# Altium project TU_ADV_PRJ.PrjPcb
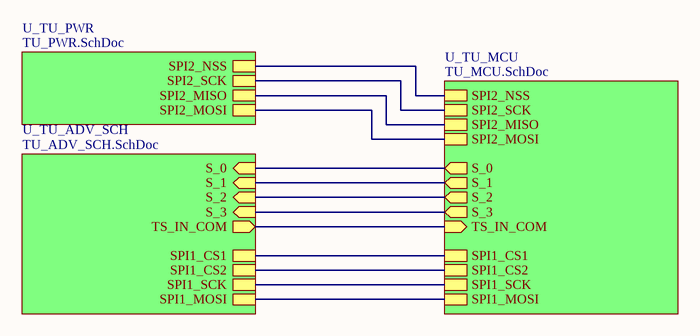
[diagram p0: TU_MAIN.SchDoc]
4 sheets, 200 parts. Net scope: hierarchical (ports join the sheet entries above them; power ports are global).
Board file: TU_ADV_PCB.PcbDoc
Sheets:
  TU_MAIN.SchDoc
    U_TU_PWR = TU_PWR.SchDoc
    U_TU_MCU = TU_MCU.SchDoc
    U_TU_ADV_SCH = TU_ADV_SCH.SchDoc

## Sheet TU_MAIN.SchDoc
size 1651 x 1651 mm

### Sub-sheets
U_TU_ADV_SCH = TU_ADV_SCH.SchDoc: TS_IN_COM (out), SPI1_CS1, SPI1_CS2, SPI1_MOSI, SPI1_SCK, S_0 (in), S_1 (in), S_2 (in), S_3 (in)
U_TU_MCU = TU_MCU.SchDoc: SPI2_NSS, SPI2_SCK, SPI2_MISO, SPI2_MOSI, S_0 (out), S_1 (out), S_2 (out), S_3 (out), TS_IN_COM (in), SPI1_CS2, SPI1_SCK, SPI1_MOSI, SPI1_CS1
U_TU_PWR = TU_PWR.SchDoc: SPI2_NSS, SPI2_MOSI, SPI2_MISO, SPI2_SCK

### Nets
SPI1_MOSI: sheet U_TU_MCU/SPI1_MOSI, sheet U_TU_ADV_SCH/SPI1_MOSI
SPI1_SCK: sheet U_TU_MCU/SPI1_SCK, sheet U_TU_ADV_SCH/SPI1_SCK
SPI2_MISO: sheet U_TU_PWR/SPI2_MISO, sheet U_TU_MCU/SPI2_MISO
SPI2_MOSI: sheet U_TU_PWR/SPI2_MOSI, sheet U_TU_MCU/SPI2_MOSI
SPI2_NSS: sheet U_TU_PWR/SPI2_NSS, sheet U_TU_MCU/SPI2_NSS
SPI2_SCK: sheet U_TU_PWR/SPI2_SCK, sheet U_TU_MCU/SPI2_SCK
NetR145_2: sheet U_TU_MCU/SPI1_CS1, sheet U_TU_ADV_SCH/SPI1_CS1
NetR146_2: sheet U_TU_MCU/SPI1_CS2, sheet U_TU_ADV_SCH/SPI1_CS2
NetU34_1: sheet U_TU_MCU/TS_IN_COM, sheet U_TU_ADV_SCH/TS_IN_COM
NetU34_10: sheet U_TU_MCU/S_0, sheet U_TU_ADV_SCH/S_0
NetU34_11: sheet U_TU_MCU/S_1, sheet U_TU_ADV_SCH/S_1
NetU34_13: sheet U_TU_MCU/S_3, sheet U_TU_ADV_SCH/S_3
NetU34_14: sheet U_TU_MCU/S_2, sheet U_TU_ADV_SCH/S_2

## Sheet TU_PWR.SchDoc
size A0
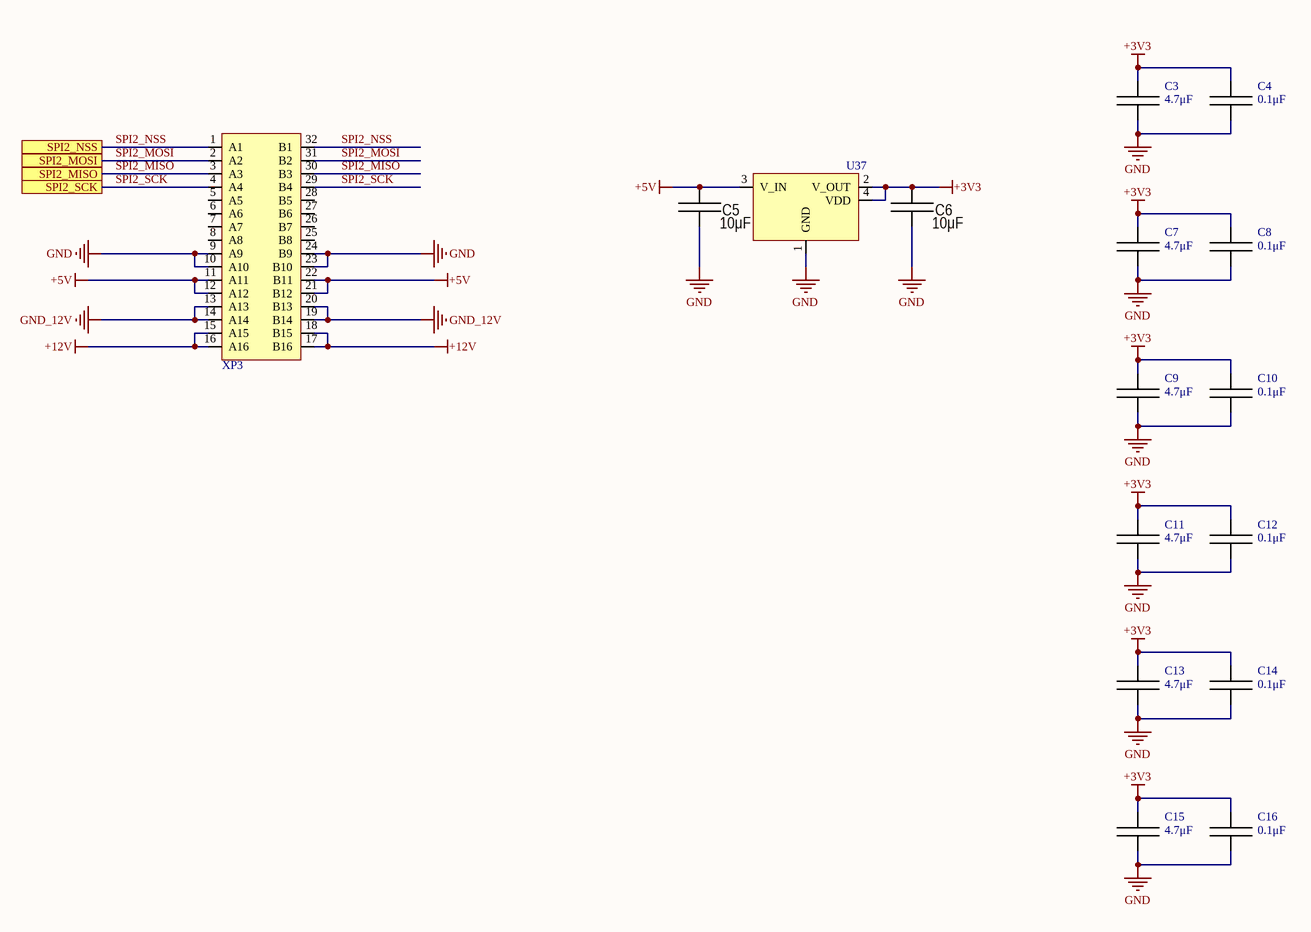
[diagram p1: TU_PWR.SchDoc]

### Parts
C3  value 4.7μF  [CAP: 0603]  (hidden comment: Cap_0603)
C4  value 0.1μF  [CAP: 0603]  (hidden comment: Cap_0603)
C5  value 10μF  [CAP: 1210]
C6  value 10μF  [CAP: 1210]
C7  value 4.7μF  [CAP: 0603]  (hidden comment: Cap_0603)
C8  value 0.1μF  [CAP: 0603]  (hidden comment: Cap_0603)
C9  value 4.7μF  [CAP: 0603]  (hidden comment: Cap_0603)
C10  value 0.1μF  [CAP: 0603]  (hidden comment: Cap_0603)
C11  value 4.7μF  [CAP: 0603]  (hidden comment: Cap_0603)
C12  value 0.1μF  [CAP: 0603]  (hidden comment: Cap_0603)
C13  value 4.7μF  [CAP: 0603]  (hidden comment: Cap_0603)
C14  value 0.1μF  [CAP: 0603]  (hidden comment: Cap_0603)
C15  value 4.7μF  [CAP: 0603]  (hidden comment: Cap_0603)
C16  value 0.1μF  [CAP: 0603]  (hidden comment: Cap_0603)
U37  LD1117S33CTR4  [SOT-223-3]  (value not drawn)
XP3  DS1118-32M-R23  [DS1118-32M-R23]  (value not drawn)

### Ports
SPI2_MISO, SPI2_MOSI, SPI2_NSS, SPI2_SCK

### Nets
+3V3: C3.2 C4.2 C6.2 C7.2 C8.2 C9.2 C10.2 C11.2 C12.2 C13.2 C14.2 C15.2 C16.2 U37.2(V_OUT) U37.4(VDD)  [project net VCC_3.3V_CLEAR]
+5V: C5.2 U37.3(V_IN) XP3.11(A11) XP3.12(A12) XP3.21(B12) XP3.22(B11)
+12V: XP3.15(A15) XP3.16(A16) XP3.17(B16) XP3.18(B15)
GND: C3.1 C4.1 C5.1 C6.1 C7.1 C8.1 C9.1 C10.1 C11.1 C12.1 C13.1 C14.1 C15.1 C16.1 U37.1(GND) XP3.9(A9) XP3.10(A10) XP3.23(B10) XP3.24(B9)
GND_12V: XP3.13(A13) XP3.14(A14) XP3.19(B14) XP3.20(B13)
SPI2_MISO: XP3.3(A3) XP3.30(B3) ; port SPI2_MISO
SPI2_MOSI: XP3.2(A2) XP3.31(B2) ; port SPI2_MOSI
SPI2_NSS: XP3.1(A1) XP3.32(B1) ; port SPI2_NSS
SPI2_SCK: XP3.4(A4) XP3.29(B4) ; port SPI2_SCK

Not connected (* = marked no-connect by the designer): XP3 5(A5) 6(A6) 7(A7) 8(A8) 25(B8) 26(B7) 27(B6) 28(B5)

### Library data of the parts
C3 C7 C9 C11 C13 C15 = Cap_0603: TypeDielectric: X7R(X5R); Voltage: 25V; Package/Case: 0603; Temperature: -55...+125°C(-55...+85°C); Product Category: Capacitors
C4 C8 C10 C12 C14 C16 = Cap_0603: TypeDielectric: X7R(X5R); Voltage: 16V; Package/Case: 0603; Temperature: -55...+125°C(-55...+85°C); Product Category: Capacitors
C5 C6 = Ceramic_1210: Manufacturer: Yageo; PartNumber: CC1210KKX7R9BB104; TypeCapacitor: Ceramic capacitor; Tolerance: ±10%; TypeDielectric: X7R; Package: 1210; HelpURL: https://www.digikey.com/product-detail/en/yageo/CC1210KKX7R9BB104/311-4522-1-ND/8025611; ValueManufacturerPartNumber: =TypeCapacitor+', '+Value+', '+TypeDielectric+', '+Tolerance+', '+Voltage+', '+Package+', '+Temperature; Temperature: -55...+125°C
U37 = LD1117S33CTR: LDO Voltage Regulator 3.3V 0.8A Positive; Manufacturer: STMicroelectronics; Datasheet: https://eu.mouser.com/datasheet/2/389/cd00000544-1795431.pdf; HelpURL: https://eu.mouser.com/ProductDetail/STMicroelectronics/LD1117S33CTR?qs=8u%2FLf1IQwKF9meFZLHfRog%3D%3D; Package/Case: SOT-223-3; Product Category: Voltage Regulators
XP3 = DS1118-32M-R23: DIN 41612 Connector; Manufacturer: Connfly; Analogue: HARTING 09221326951(https://eu.mouser.com/ProductDetail/HARTING/09221326951?qs=Afqhj6cPmO9f0oVZo6yWiA%3D%3D); Datasheet: http://en.connfly.group/static/upload/file/pdf/DS1118.pdf; HelpURL: https://www.chipdip.by/product/din41612r-ds1118-32m-r23; Product Category: Connectors

## Sheet TU_MCU.SchDoc
size 500 x 500 mm
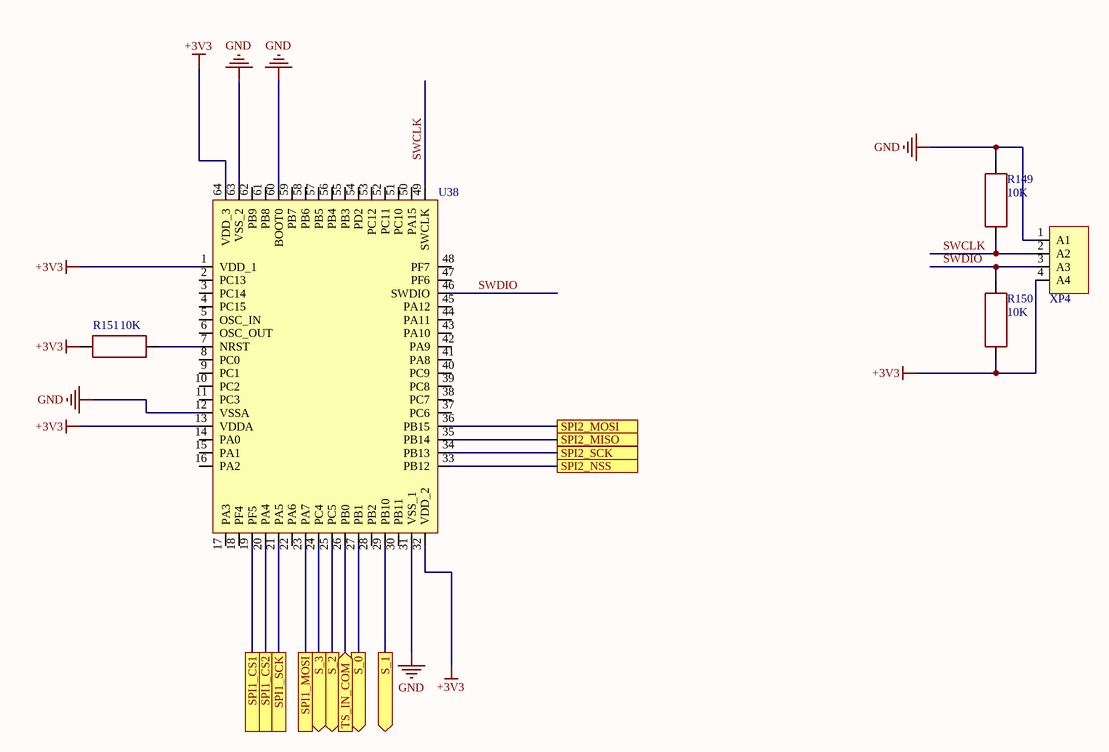
[diagram p2: TU_MCU.SchDoc]

### Parts
R149  value 10K  [RES: 0603]  (hidden comment: Resistor_0603)
R150  value 10K  [RES: 0603]  (hidden comment: Resistor_0603)
R151  value 10K  [RES: 0603]  (hidden comment: Resistor_0603)
U38  STM32F030R8T6TR  [LQFP-64]  (value not drawn)
XP4  PLS-6 (DS1021-1x6)  [PLS-4 (DS1021-1x4)]  (value not drawn)

### Ports
S_0 (out), S_1 (out), S_2 (out), S_3 (out), SPI1_CS1, SPI1_CS2, SPI1_MOSI, SPI1_SCK, SPI2_MISO, SPI2_MOSI, SPI2_NSS, SPI2_SCK, TS_IN_COM (in)

### Nets
+3V3: R150.2 R151.1 U38.1(VDD_1) U38.13(VDDA) U38.32(VDD_2) U38.64(VDD_3) XP4.4(A4)  [project net VCC_3.3V_CLEAR]
GND: R149.1 U38.12(VSSA) U38.31(VSS_1) U38.60(BOOT0) U38.63(VSS_2) XP4.1(A1)
SPI1_MOSI: U38.23(PA7) ; port SPI1_MOSI
SPI1_SCK: U38.21(PA5) ; port SPI1_SCK
SPI2_MISO: U38.35(PB14) ; port SPI2_MISO
SPI2_MOSI: U38.36(PB15) ; port SPI2_MOSI
SPI2_NSS: U38.33(PB12) ; port SPI2_NSS
SPI2_SCK: U38.34(PB13) ; port SPI2_SCK
SWCLK: R149.2 U38.49(SWCLK) XP4.2(A2)
SWDIO: R150.1 U38.46(SWDIO) XP4.3(A3)
NetR145_2: U38.19(PF5) ; port SPI1_CS1
NetR146_2: U38.20(PA4) ; port SPI1_CS2
NetR151_2: R151.2 U38.7(NRST)
NetU34_1: U38.26(PB0) ; port TS_IN_COM
NetU34_10: U38.27(PB1) ; port S_0
NetU34_11: U38.29(PB10) ; port S_1
NetU34_13: U38.24(PC4) ; port S_3
NetU34_14: U38.25(PC5) ; port S_2

Not connected (* = marked no-connect by the designer): U38 2(PC13) 3(PC14) 4(PC15) 5(OSC_IN) 6(OSC_OUT) 8(PC0) 9(PC1) 10(PC2) 11(PC3) 14(PA0) 15(PA1) 16(PA2) 17(PA3) 18(PF4) 22(PA6) 28(PB2) 30(PB11) 37(PC6) 38(PC7) 39(PC8) 40(PC9) 41(PA8) 42(PA9) 43(PA10) 44(PA11) 45(PA12) 47(PF6) 48(PF7) 50(PA15) 51(PC10) 52(PC11) 53(PC12) 54(PD2) 55(PB3) 56(PB4) 57(PB5) 58(PB6) 59(PB7) 61(PB8) 62(PB9)

### Library data of the parts
R149-R151 = Resistor_0603: Power: 0.1W; Tolerance: ±1%; Package/Case: 0603; Temperature: -55...+125°C; Product Category: Resistors
U38 = STM32F030R8T6TR: MCU Mainstream Arm Cortex-M0 Value line MCU 64 Kbytes of Flash , 48 MHz CPU; Manufacturer: STMicroelectronics; Datasheet: https://www.st.com/resource/en/datasheet/stm32f030r8.pdf; HelpURL: https://eu.mouser.com/ProductDetail/STMicroelectronics/STM32F030R8T6TR?qs=s5SkPsIz10%252B%252B1w15QiyTpQ%3D%3D; Package/Case: LQFP-64; Product Category: Microcontrollers
XP4 = PLS-4 (DS1021-1x4): Board to Board, Surface Mount, Single row, 6 Positions, 2.54mm, Vertical.; Manufacturer: Connfly; Datasheet: https://static.chipdip.ru/lib/977/DOC005977245.pdf; HelpURL: https://www.chipdip.by/product/pls-4; Product Category: Connectors

## Sheet TU_ADV_SCH.SchDoc
size 1651 x 1651 mm
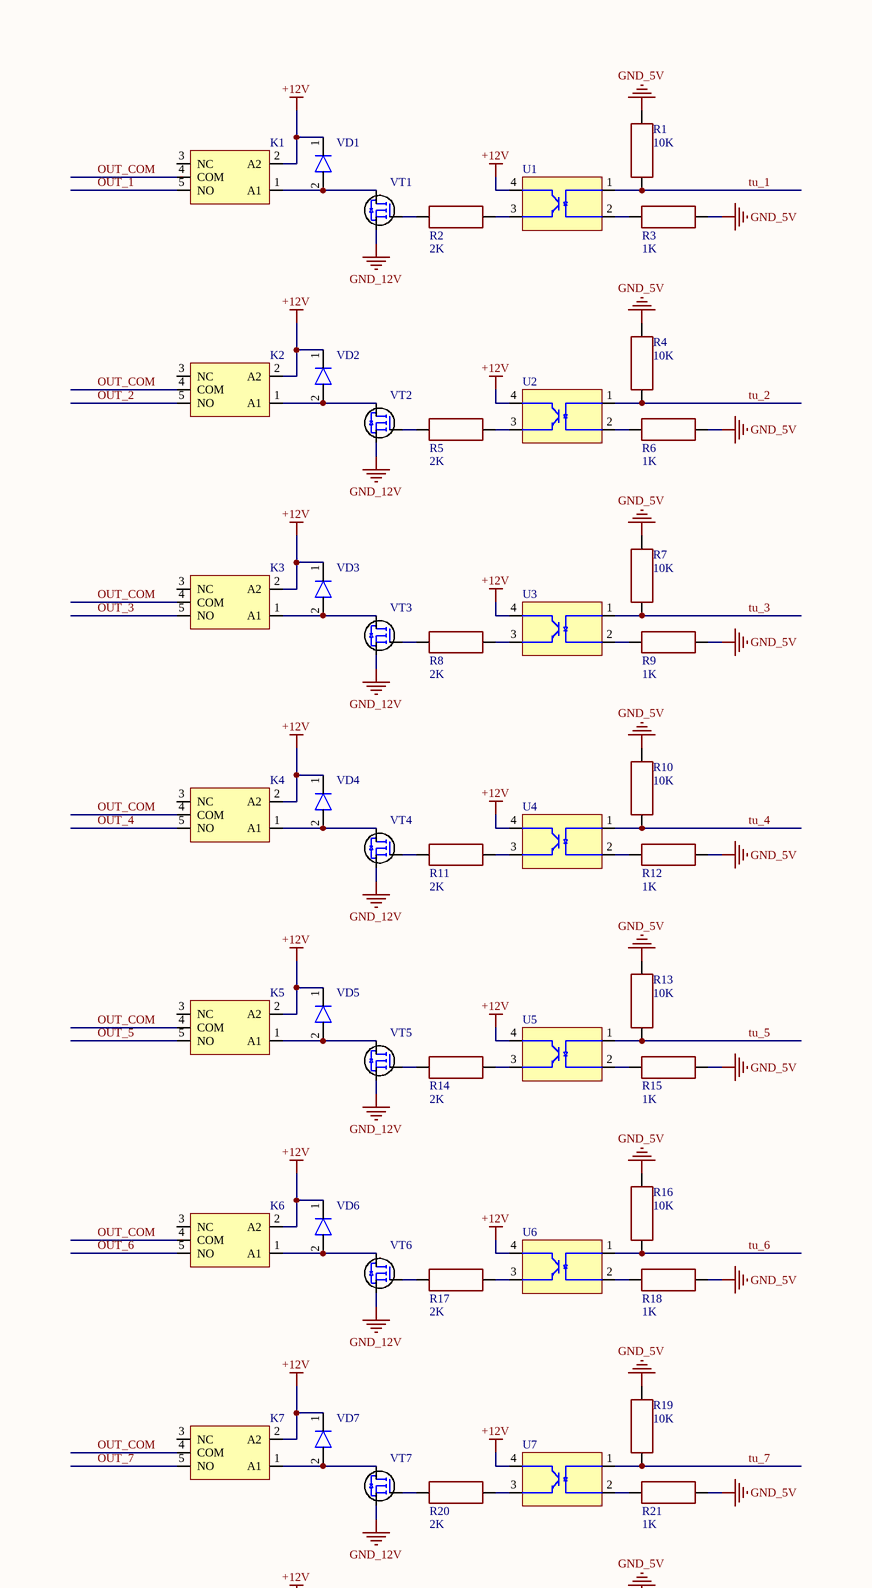
[diagram p3: TU_ADV_SCH.SchDoc, row 1 of 5 left]
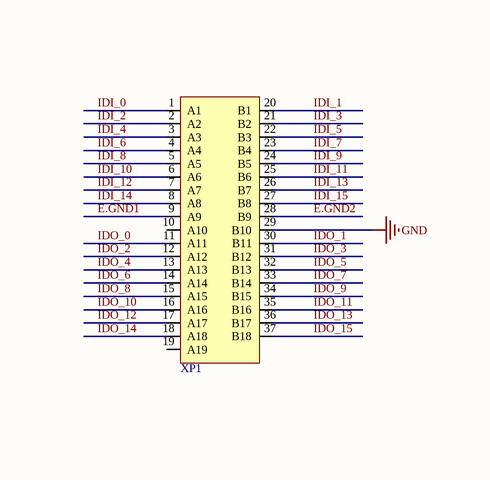
[diagram p4: TU_ADV_SCH.SchDoc, row 1 of 5 right]
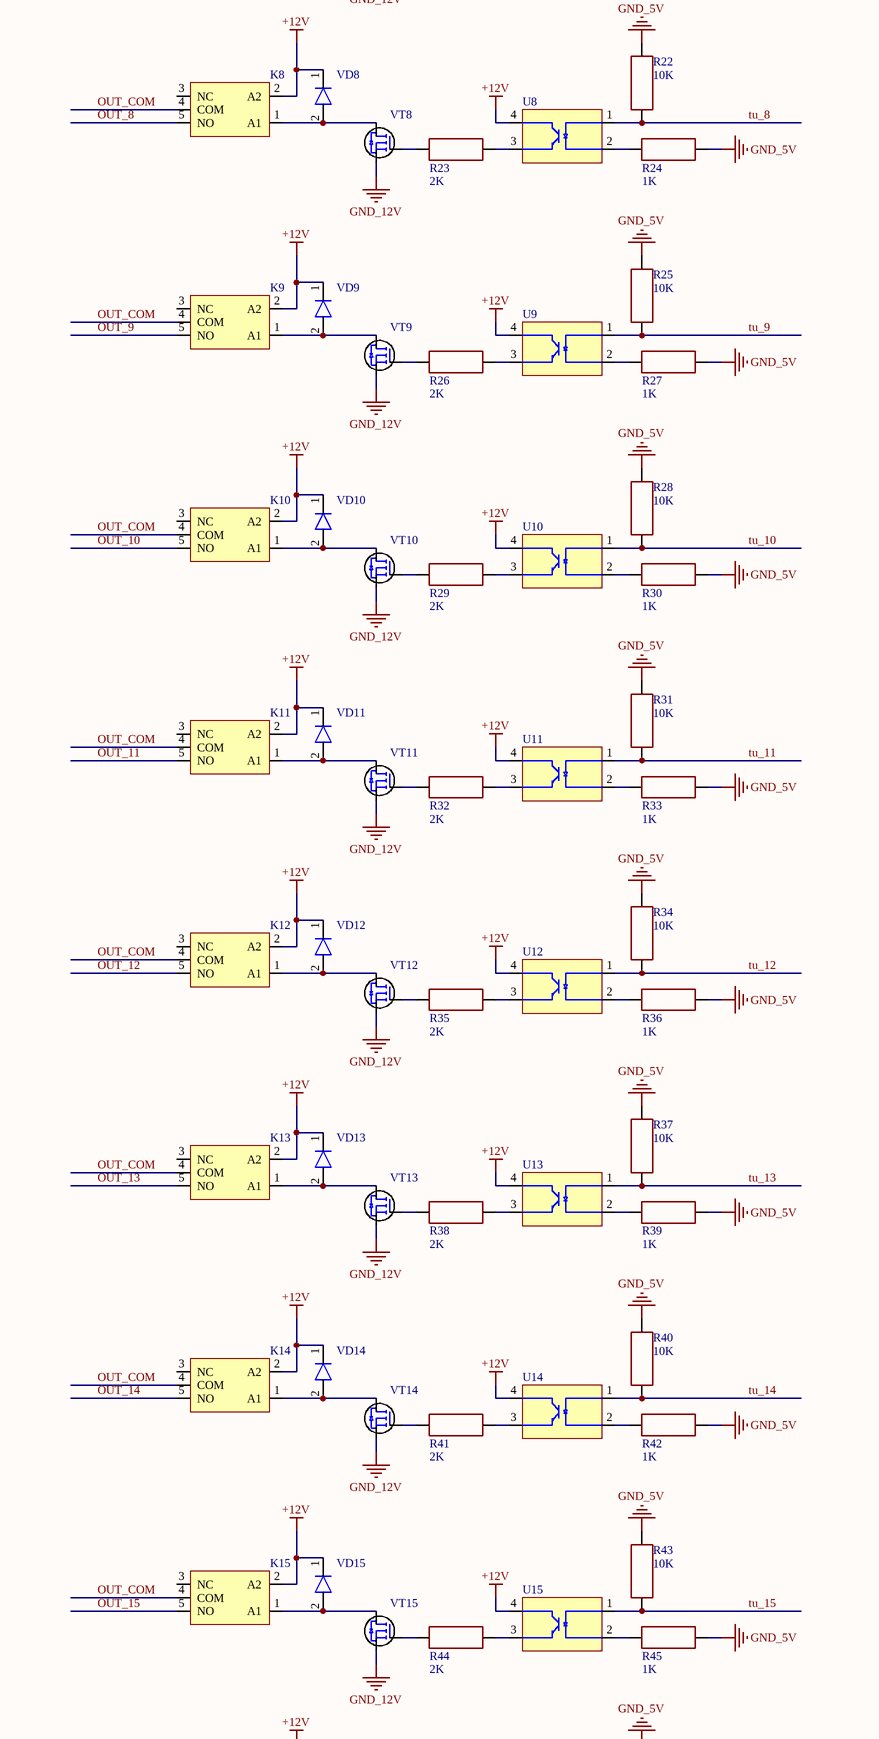
[diagram p5: TU_ADV_SCH.SchDoc, row 2 of 5 left]
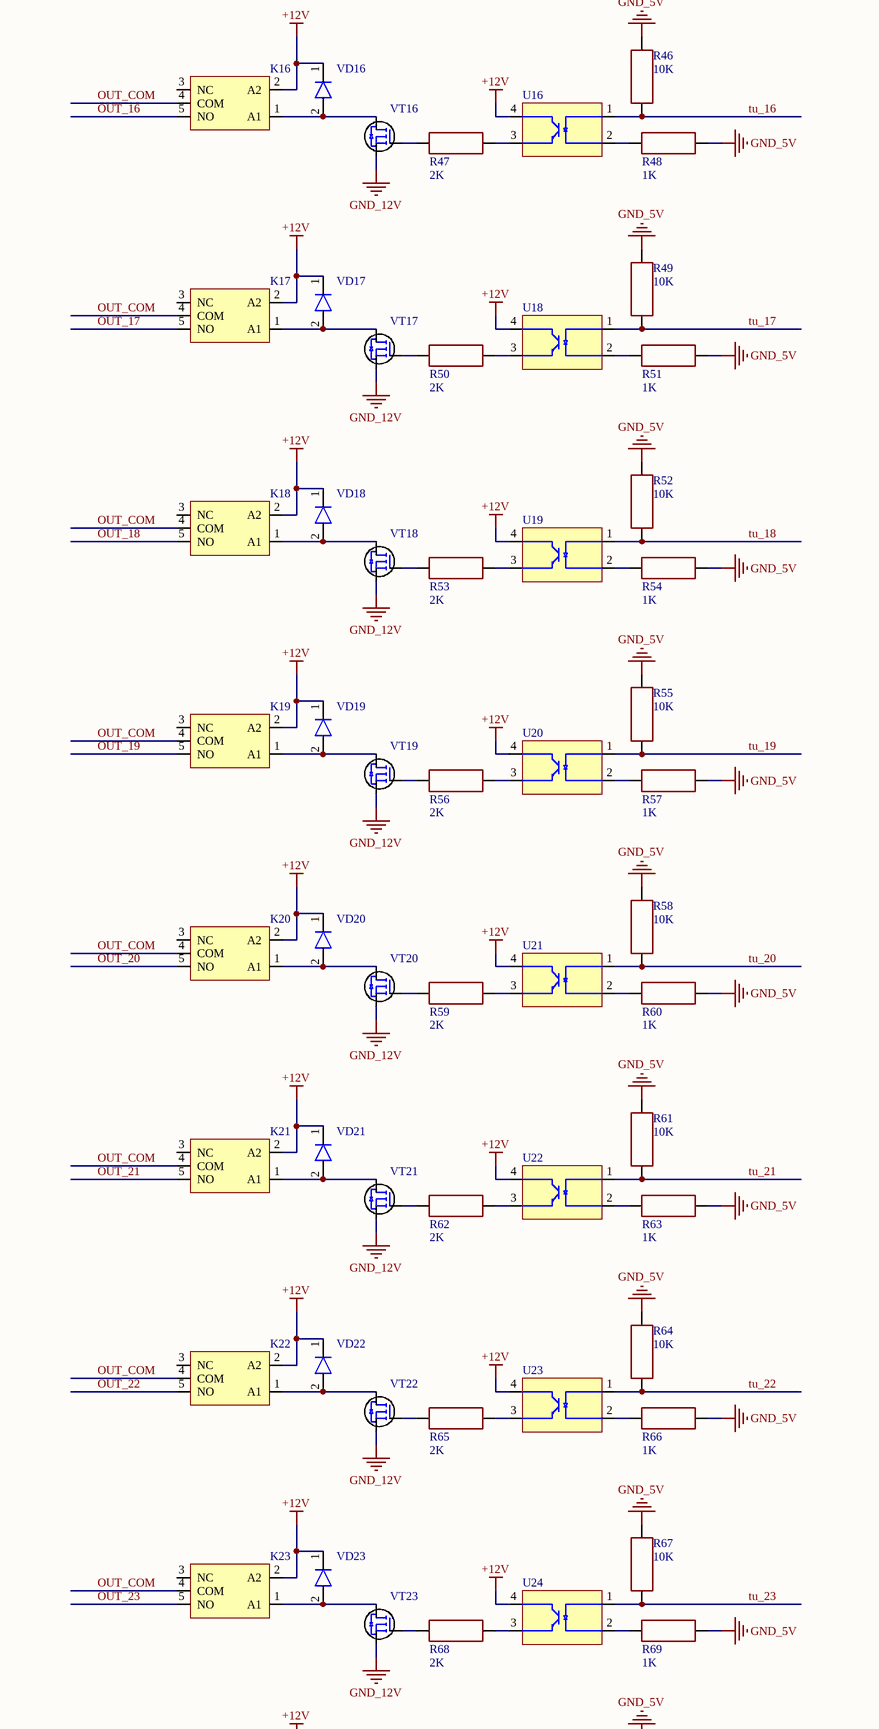
[diagram p6: TU_ADV_SCH.SchDoc, row 3 of 5 left]
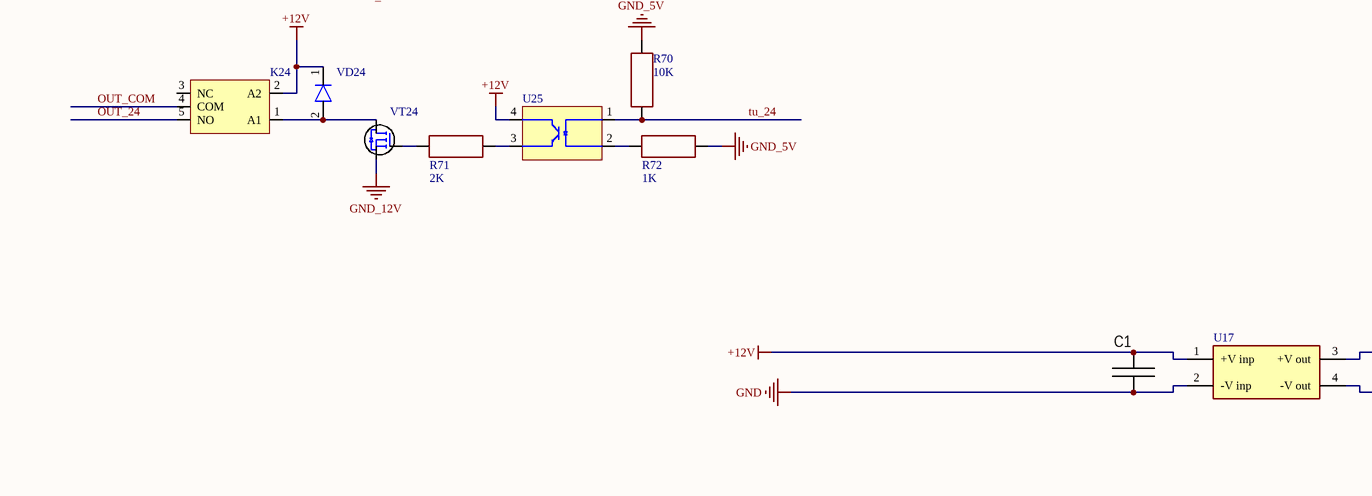
[diagram p7: TU_ADV_SCH.SchDoc, row 4 of 5 left]
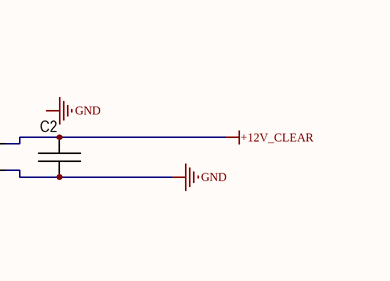
[diagram p8: TU_ADV_SCH.SchDoc, row 4 of 5 right]
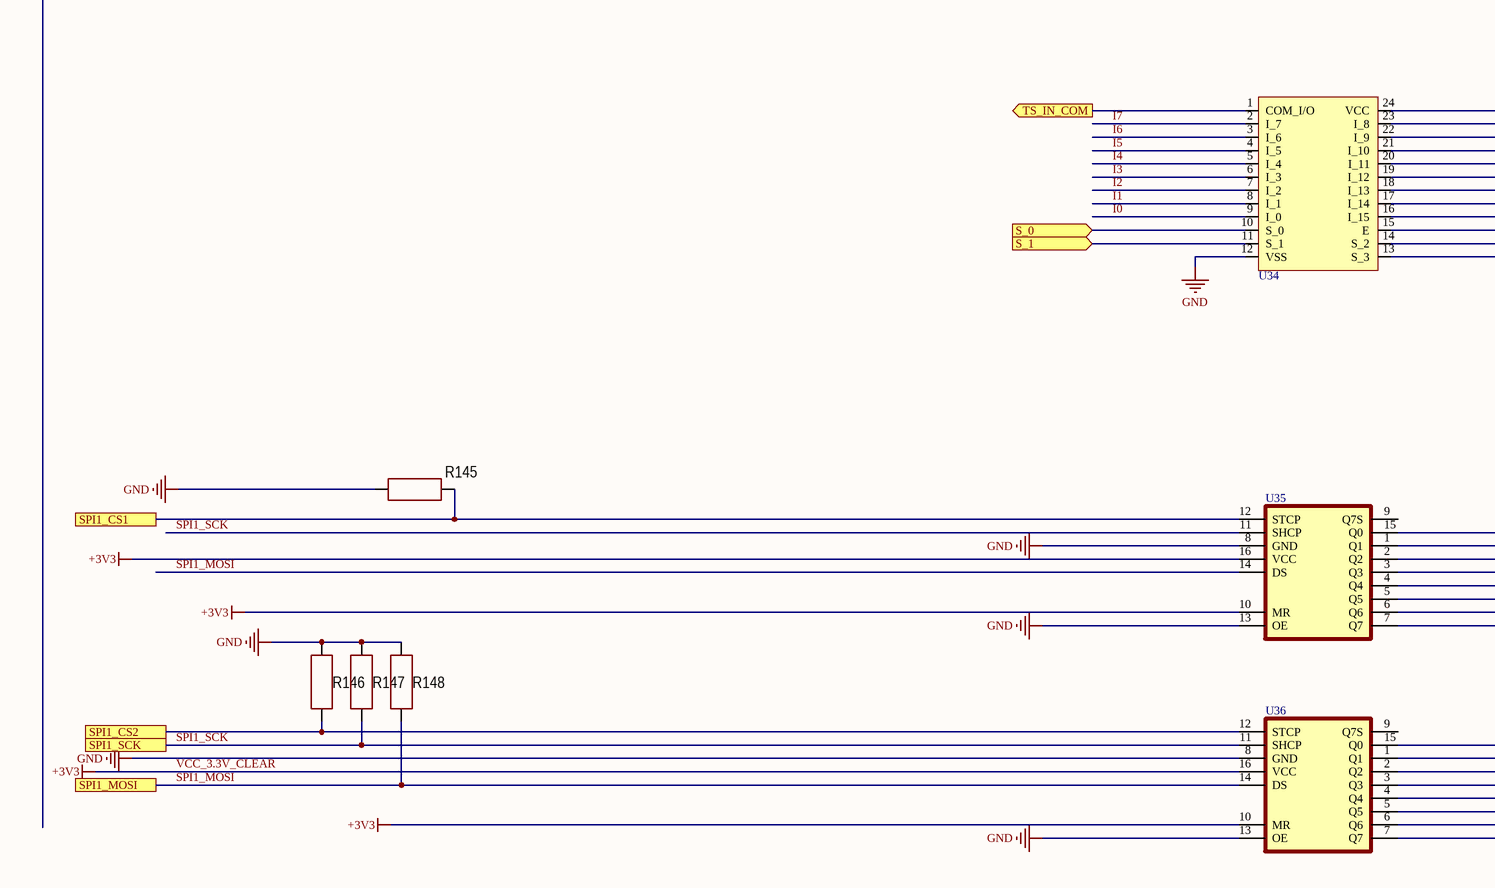
[diagram p9: TU_ADV_SCH.SchDoc, row 5 of 5 left]
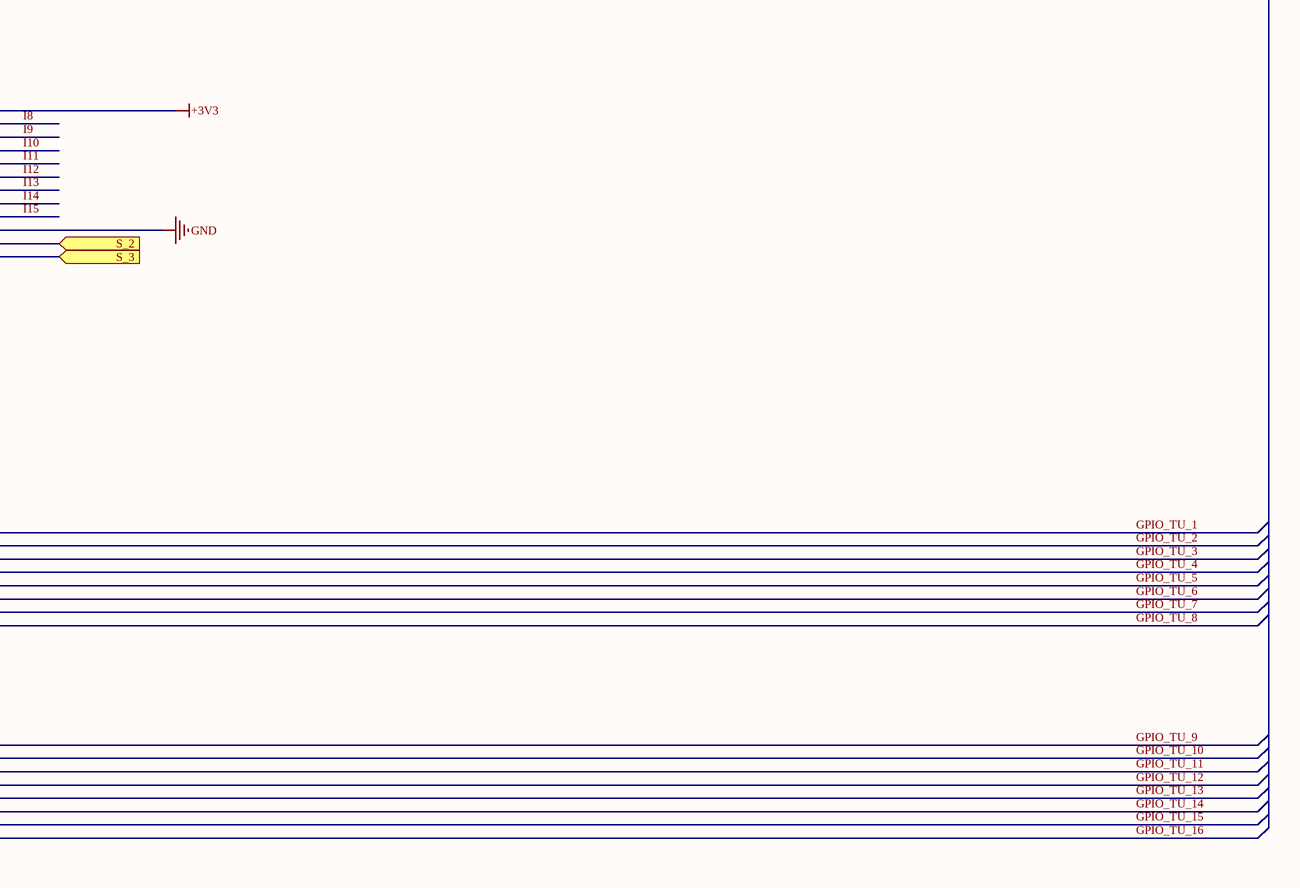
[diagram p10: TU_ADV_SCH.SchDoc, row 5 of 5 right]

### Parts
C1  (no value)  [CAP: 2220]
C2  (no value)  [CAP: 2220]
K1  RM96-3011-35-1012  [RM96]  (value not drawn)
K2  RM96-3011-35-1012  [RM96]  (value not drawn)
K3  RM96-3011-35-1012  [RM96]  (value not drawn)
K4  RM96-3011-35-1012  [RM96]  (value not drawn)
K5  RM96-3011-35-1012  [RM96]  (value not drawn)
K6  RM96-3011-35-1012  [RM96]  (value not drawn)
K7  RM96-3011-35-1012  [RM96]  (value not drawn)
K8  RM96-3011-35-1012  [RM96]  (value not drawn)
K9  RM96-3011-35-1012  [RM96]  (value not drawn)
K10  RM96-3011-35-1012  [RM96]  (value not drawn)
K11  RM96-3011-35-1012  [RM96]  (value not drawn)
K12  RM96-3011-35-1012  [RM96]  (value not drawn)
K13  RM96-3011-35-1012  [RM96]  (value not drawn)
K14  RM96-3011-35-1012  [RM96]  (value not drawn)
K15  RM96-3011-35-1012  [RM96]  (value not drawn)
K16  RM96-3011-35-1012  [RM96]  (value not drawn)
K17  RM96-3011-35-1012  [RM96]  (value not drawn)
K18  RM96-3011-35-1012  [RM96]  (value not drawn)
K19  RM96-3011-35-1012  [RM96]  (value not drawn)
K20  RM96-3011-35-1012  [RM96]  (value not drawn)
K21  RM96-3011-35-1012  [RM96]  (value not drawn)
K22  RM96-3011-35-1012  [RM96]  (value not drawn)
K23  RM96-3011-35-1012  [RM96]  (value not drawn)
K24  RM96-3011-35-1012  [RM96]  (value not drawn)
R1  value 10K  [RES: 0402]
R2  value 2K  [RES: 0402]
R3  value 1K  [RES: 0402]
R4  value 10K  [RES: 0402]
R5  value 2K  [RES: 0402]
R6  value 1K  [RES: 0402]
R7  value 10K  [RES: 0402]
R8  value 2K  [RES: 0402]
R9  value 1K  [RES: 0402]
R10  value 10K  [RES: 0402]
R11  value 2K  [RES: 0402]
R12  value 1K  [RES: 0402]
R13  value 10K  [RES: 0402]
R14  value 2K  [RES: 0402]
R15  value 1K  [RES: 0402]
R16  value 10K  [RES: 0402]
R17  value 2K  [RES: 0402]
R18  value 1K  [RES: 0402]
R19  value 10K  [RES: 0402]
R20  value 2K  [RES: 0402]
R21  value 1K  [RES: 0402]
R22  value 10K  [RES: 0402]
R23  value 2K  [RES: 0402]
R24  value 1K  [RES: 0402]
R25  value 10K  [RES: 0402]
R26  value 2K  [RES: 0402]
R27  value 1K  [RES: 0402]
R28  value 10K  [RES: 0402]
R29  value 2K  [RES: 0402]
R30  value 1K  [RES: 0402]
R31  value 10K  [RES: 0402]
R32  value 2K  [RES: 0402]
R33  value 1K  [RES: 0402]
R34  value 10K  [RES: 0402]
R35  value 2K  [RES: 0402]
R36  value 1K  [RES: 0402]
R37  value 10K  [RES: 0402]
R38  value 2K  [RES: 0402]
R39  value 1K  [RES: 0402]
R40  value 10K  [RES: 0402]
R41  value 2K  [RES: 0402]
R42  value 1K  [RES: 0402]
R43  value 10K  [RES: 0402]
R44  value 2K  [RES: 0402]
R45  value 1K  [RES: 0402]
R46  value 10K  [RES: 0402]
R47  value 2K  [RES: 0402]
R48  value 1K  [RES: 0402]
R49  value 10K  [RES: 0402]
R50  value 2K  [RES: 0402]
R51  value 1K  [RES: 0402]
R52  value 10K  [RES: 0402]
R53  value 2K  [RES: 0402]
R54  value 1K  [RES: 0402]
R55  value 10K  [RES: 0402]
R56  value 2K  [RES: 0402]
R57  value 1K  [RES: 0402]
R58  value 10K  [RES: 0402]
R59  value 2K  [RES: 0402]
R60  value 1K  [RES: 0402]
R61  value 10K  [RES: 0402]
R62  value 2K  [RES: 0402]
R63  value 1K  [RES: 0402]
R64  value 10K  [RES: 0402]
R65  value 2K  [RES: 0402]
R66  value 1K  [RES: 0402]
R67  value 10K  [RES: 0402]
R68  value 2K  [RES: 0402]
R69  value 1K  [RES: 0402]
R70  value 10K  [RES: 0402]
R71  value 2K  [RES: 0402]
R72  value 1K  [RES: 0402]
R145  (no value)  [RES: 0603]
R146  (no value)  [RES: 0603]
R147  (no value)  [RES: 0603]
R148  (no value)  [RES: 0603]
U1  LTV-357T  [SMD-4]  (value not drawn)
U2  LTV-357T  [SMD-4]  (value not drawn)
U3  LTV-357T  [SMD-4]  (value not drawn)
U4  LTV-357T  [SMD-4]  (value not drawn)
U5  LTV-357T  [SMD-4]  (value not drawn)
U6  LTV-357T  [SMD-4]  (value not drawn)
U7  LTV-357T  [SMD-4]  (value not drawn)
U8  LTV-357T  [SMD-4]  (value not drawn)
U9  LTV-357T  [SMD-4]  (value not drawn)
U10  LTV-357T  [SMD-4]  (value not drawn)
U11  LTV-357T  [SMD-4]  (value not drawn)
U12  LTV-357T  [SMD-4]  (value not drawn)
U13  LTV-357T  [SMD-4]  (value not drawn)
U14  LTV-357T  [SMD-4]  (value not drawn)
U15  LTV-357T  [SMD-4]  (value not drawn)
U16  LTV-357T  [SMD-4]  (value not drawn)
U17  AM1D-1212SH  [AM1D-1212SH]  (value not drawn)
U18  LTV-357T  [SMD-4]  (value not drawn)
U19  LTV-357T  [SMD-4]  (value not drawn)
U20  LTV-357T  [SMD-4]  (value not drawn)
U21  LTV-357T  [SMD-4]  (value not drawn)
U22  LTV-357T  [SMD-4]  (value not drawn)
U23  LTV-357T  [SMD-4]  (value not drawn)
U24  LTV-357T  [SMD-4]  (value not drawn)
U25  LTV-357T  [SMD-4]  (value not drawn)
U34  CD74HC4067M96  [SOIC-24]  (value not drawn)
U35  74HC595  [74HC595]  (value not drawn)
U36  74HC595  [74HC595]  (value not drawn)
VD1  1N4148W-7-F  [SOD-123]  (value not drawn)
VD2  1N4148W-7-F  [SOD-123]  (value not drawn)
VD3  1N4148W-7-F  [SOD-123]  (value not drawn)
VD4  1N4148W-7-F  [SOD-123]  (value not drawn)
VD5  1N4148W-7-F  [SOD-123]  (value not drawn)
VD6  1N4148W-7-F  [SOD-123]  (value not drawn)
VD7  1N4148W-7-F  [SOD-123]  (value not drawn)
VD8  1N4148W-7-F  [SOD-123]  (value not drawn)
VD9  1N4148W-7-F  [SOD-123]  (value not drawn)
VD10  1N4148W-7-F  [SOD-123]  (value not drawn)
VD11  1N4148W-7-F  [SOD-123]  (value not drawn)
VD12  1N4148W-7-F  [SOD-123]  (value not drawn)
VD13  1N4148W-7-F  [SOD-123]  (value not drawn)
VD14  1N4148W-7-F  [SOD-123]  (value not drawn)
VD15  1N4148W-7-F  [SOD-123]  (value not drawn)
VD16  1N4148W-7-F  [SOD-123]  (value not drawn)
VD17  1N4148W-7-F  [SOD-123]  (value not drawn)
VD18  1N4148W-7-F  [SOD-123]  (value not drawn)
VD19  1N4148W-7-F  [SOD-123]  (value not drawn)
VD20  1N4148W-7-F  [SOD-123]  (value not drawn)
VD21  1N4148W-7-F  [SOD-123]  (value not drawn)
VD22  1N4148W-7-F  [SOD-123]  (value not drawn)
VD23  1N4148W-7-F  [SOD-123]  (value not drawn)
VD24  1N4148W-7-F  [SOD-123]  (value not drawn)
VT1  2N7002(NX7002AK)  [SOT-23-3]  (value not drawn)
VT2  2N7002(NX7002AK)  [SOT-23-3]  (value not drawn)
VT3  2N7002(NX7002AK)  [SOT-23-3]  (value not drawn)
VT4  2N7002(NX7002AK)  [SOT-23-3]  (value not drawn)
VT5  2N7002(NX7002AK)  [SOT-23-3]  (value not drawn)
VT6  2N7002(NX7002AK)  [SOT-23-3]  (value not drawn)
VT7  2N7002(NX7002AK)  [SOT-23-3]  (value not drawn)
VT8  2N7002(NX7002AK)  [SOT-23-3]  (value not drawn)
VT9  2N7002(NX7002AK)  [SOT-23-3]  (value not drawn)
VT10  2N7002(NX7002AK)  [SOT-23-3]  (value not drawn)
VT11  2N7002(NX7002AK)  [SOT-23-3]  (value not drawn)
VT12  2N7002(NX7002AK)  [SOT-23-3]  (value not drawn)
VT13  2N7002(NX7002AK)  [SOT-23-3]  (value not drawn)
VT14  2N7002(NX7002AK)  [SOT-23-3]  (value not drawn)
VT15  2N7002(NX7002AK)  [SOT-23-3]  (value not drawn)
VT16  2N7002(NX7002AK)  [SOT-23-3]  (value not drawn)
VT17  2N7002(NX7002AK)  [SOT-23-3]  (value not drawn)
VT18  2N7002(NX7002AK)  [SOT-23-3]  (value not drawn)
VT19  2N7002(NX7002AK)  [SOT-23-3]  (value not drawn)
VT20  2N7002(NX7002AK)  [SOT-23-3]  (value not drawn)
VT21  2N7002(NX7002AK)  [SOT-23-3]  (value not drawn)
VT22  2N7002(NX7002AK)  [SOT-23-3]  (value not drawn)
VT23  2N7002(NX7002AK)  [SOT-23-3]  (value not drawn)
VT24  2N7002(NX7002AK)  [SOT-23-3]  (value not drawn)
XP1  DRB-37FA(DS1037-37F)  [DRB-37FA(DS1037-37F)]  (value not drawn)

### Ports
S_0 (in), S_1 (in), S_2 (in), S_3 (in), SPI1_CS1, SPI1_CS2, SPI1_MOSI, SPI1_SCK, TS_IN_COM (out)

### Nets
+12V: C1.2 K1.2(A2) K2.2(A2) K3.2(A2) K4.2(A2) K5.2(A2) K6.2(A2) K7.2(A2) K8.2(A2) K9.2(A2) K10.2(A2) K11.2(A2) K12.2(A2) K13.2(A2) K14.2(A2) K15.2(A2) K16.2(A2) K17.2(A2) K18.2(A2) K19.2(A2) K20.2(A2) K21.2(A2) K22.2(A2) K23.2(A2) K24.2(A2) U1.4 U2.4 U3.4 U4.4 U5.4 U6.4 U7.4 U8.4 U9.4 U10.4 U11.4 U12.4 U13.4 U14.4 U15.4 U16.4 U17.1(+V_inp) U18.4 U19.4 U20.4 U21.4 U22.4 U23.4 U24.4 U25.4 VD1.1 VD2.1 VD3.1 VD4.1 VD5.1 VD6.1 VD7.1 VD8.1 VD9.1 VD10.1 VD11.1 VD12.1 VD13.1 VD14.1 VD15.1 VD16.1 VD17.1 VD18.1 VD19.1 VD20.1 VD21.1 VD22.1 VD23.1 VD24.1
+12V_CLEAR: C2.2 U17.3(+V_out)
GND: C1.1 C2.1 R145.1 R146.1 R147.1 R148.1 U17.2(-V_inp) U17.4(-V_out) U34.12(VSS) U34.15(E) U35.8(GND) U35.13(OE) U36.8(GND) U36.13(OE) XP1.29(B10)
GND_5V: R1.2 R3.2 R4.2 R6.2 R7.2 R9.2 R10.2 R12.2 R13.2 R15.2 R16.2 R18.2 R19.2 R21.2 R22.2 R24.2 R25.2 R27.2 R28.2 R30.2 R31.2 R33.2 R34.2 R36.2 R37.2 R39.2 R40.2 R42.2 R43.2 R45.2 R46.2 R48.2 R49.2 R51.2 R52.2 R54.2 R55.2 R57.2 R58.2 R60.2 R61.2 R63.2 R64.2 R66.2 R67.2 R69.2 R70.2 R72.2
GND_12V: VT1.3 VT2.3 VT3.3 VT4.3 VT5.3 VT6.3 VT7.3 VT8.3 VT9.3 VT10.3 VT11.3 VT12.3 VT13.3 VT14.3 VT15.3 VT16.3 VT17.3 VT18.3 VT19.3 VT20.3 VT21.3 VT22.3 VT23.3 VT24.3
VCC_3.3V_CLEAR: U34.24(VCC) U35.10(MR) U35.16(VCC) U36.10(MR) U36.16(VCC)  [also labelled +3V3]
E.GND1: XP1.9(A9)
E.GND2: XP1.28(B9)
GPIO_TU_1: U35.15(Q0)
GPIO_TU_2: U35.1(Q1)
GPIO_TU_3: U35.2(Q2)
GPIO_TU_4: U35.3(Q3)
GPIO_TU_5: U35.4(Q4)
GPIO_TU_6: U35.5(Q5)
GPIO_TU_7: U35.6(Q6)
GPIO_TU_8: U35.7(Q7)
GPIO_TU_9: U36.15(Q0)
GPIO_TU_10: U36.1(Q1)
GPIO_TU_11: U36.2(Q2)
GPIO_TU_12: U36.3(Q3)
GPIO_TU_13: U36.4(Q4)
GPIO_TU_14: U36.5(Q5)
GPIO_TU_15: U36.6(Q6)
GPIO_TU_16: U36.7(Q7)
I0: U34.9(I_0)
I1: U34.8(I_1)
I2: U34.7(I_2)
I3: U34.6(I_3)
I4: U34.5(I_4)
I5: U34.4(I_5)
I6: U34.3(I_6)
I7: U34.2(I_7)
I8: U34.23(I_8)
I9: U34.22(I_9)
I10: U34.21(I_10)
I11: U34.20(I_11)
I12: U34.19(I_12)
I13: U34.18(I_13)
I14: U34.17(I_14)
I15: U34.16(I_15)
IDI_0: XP1.1(A1)
IDI_1: XP1.20(B1)
IDI_2: XP1.2(A2)
IDI_3: XP1.21(B2)
IDI_4: XP1.3(A3)
IDI_5: XP1.22(B3)
IDI_6: XP1.4(A4)
IDI_7: XP1.23(B4)
IDI_8: XP1.5(A5)
IDI_9: XP1.24(B5)
IDI_10: XP1.6(A6)
IDI_11: XP1.25(B6)
IDI_12: XP1.7(A7)
IDI_13: XP1.26(B7)
IDI_14: XP1.8(A8)
IDI_15: XP1.27(B8)
IDO_0: XP1.11(A11)
IDO_1: XP1.30(B11)
IDO_2: XP1.12(A12)
IDO_3: XP1.31(B12)
IDO_4: XP1.13(A13)
IDO_5: XP1.32(B13)
IDO_6: XP1.14(A14)
IDO_7: XP1.33(B14)
IDO_8: XP1.15(A15)
IDO_9: XP1.34(B15)
IDO_10: XP1.16(A16)
IDO_11: XP1.35(B16)
IDO_12: XP1.17(A17)
IDO_13: XP1.36(B17)
IDO_14: XP1.18(A18)
IDO_15: XP1.37(B18)
OUT_1: K1.5(NO)
OUT_2: K2.5(NO)
OUT_3: K3.5(NO)
OUT_4: K4.5(NO)
OUT_5: K5.5(NO)
OUT_6: K6.5(NO)
OUT_7: K7.5(NO)
OUT_8: K8.5(NO)
OUT_9: K9.5(NO)
OUT_10: K10.5(NO)
OUT_11: K11.5(NO)
OUT_12: K12.5(NO)
OUT_13: K13.5(NO)
OUT_14: K14.5(NO)
OUT_15: K15.5(NO)
OUT_16: K16.5(NO)
OUT_17: K17.5(NO)
OUT_18: K18.5(NO)
OUT_19: K19.5(NO)
OUT_20: K20.5(NO)
OUT_21: K21.5(NO)
OUT_22: K22.5(NO)
OUT_23: K23.5(NO)
OUT_24: K24.5(NO)
OUT_COM: K1.4(COM) K2.4(COM) K3.4(COM) K4.4(COM) K5.4(COM) K6.4(COM) K7.4(COM) K8.4(COM) K9.4(COM) K10.4(COM) K11.4(COM) K12.4(COM) K13.4(COM) K14.4(COM) K15.4(COM) K16.4(COM) K17.4(COM) K18.4(COM) K19.4(COM) K20.4(COM) K21.4(COM) K22.4(COM) K23.4(COM) K24.4(COM)
SPI1_MOSI: R148.2 U35.14(DS) U36.14(DS) ; port SPI1_MOSI
SPI1_SCK: R147.2 U35.11(SHCP) U36.11(SHCP) ; port SPI1_SCK
tu_1: R1.1 U1.1
tu_2: R4.1 U2.1
tu_3: R7.1 U3.1
tu_4: R10.1 U4.1
tu_5: R13.1 U5.1
tu_6: R16.1 U6.1
tu_7: R19.1 U7.1
tu_8: R22.1 U8.1
tu_9: R25.1 U9.1
tu_10: R28.1 U10.1
tu_11: R31.1 U11.1
tu_12: R34.1 U12.1
tu_13: R37.1 U13.1
tu_14: R40.1 U14.1
tu_15: R43.1 U15.1
tu_16: R46.1 U16.1
tu_17: R49.1 U18.1
tu_18: R52.1 U19.1
tu_19: R55.1 U20.1
tu_20: R58.1 U21.1
tu_21: R61.1 U22.1
tu_22: R64.1 U23.1
tu_23: R67.1 U24.1
tu_24: R70.1 U25.1
NetK1_1: K1.1(A1) VD1.2 VT1.2
NetK2_1: K2.1(A1) VD2.2 VT2.2
NetK3_1: K3.1(A1) VD3.2 VT3.2
NetK4_1: K4.1(A1) VD4.2 VT4.2
NetK5_1: K5.1(A1) VD5.2 VT5.2
NetK6_1: K6.1(A1) VD6.2 VT6.2
NetK7_1: K7.1(A1) VD7.2 VT7.2
NetK8_1: K8.1(A1) VD8.2 VT8.2
NetK9_1: K9.1(A1) VD9.2 VT9.2
NetK10_1: K10.1(A1) VD10.2 VT10.2
NetK11_1: K11.1(A1) VD11.2 VT11.2
NetK12_1: K12.1(A1) VD12.2 VT12.2
NetK13_1: K13.1(A1) VD13.2 VT13.2
NetK14_1: K14.1(A1) VD14.2 VT14.2
NetK15_1: K15.1(A1) VD15.2 VT15.2
NetK16_1: K16.1(A1) VD16.2 VT16.2
NetK17_1: K17.1(A1) VD17.2 VT17.2
NetK18_1: K18.1(A1) VD18.2 VT18.2
NetK19_1: K19.1(A1) VD19.2 VT19.2
NetK20_1: K20.1(A1) VD20.2 VT20.2
NetK21_1: K21.1(A1) VD21.2 VT21.2
NetK22_1: K22.1(A1) VD22.2 VT22.2
NetK23_1: K23.1(A1) VD23.2 VT23.2
NetK24_1: K24.1(A1) VD24.2 VT24.2
NetR2_1: R2.1 U1.3
NetR2_2: R2.2 VT1.1
NetR3_1: R3.1 U1.2
NetR5_1: R5.1 U2.3
NetR5_2: R5.2 VT2.1
NetR6_1: R6.1 U2.2
NetR8_1: R8.1 U3.3
NetR8_2: R8.2 VT3.1
NetR9_1: R9.1 U3.2
NetR11_1: R11.1 U4.3
NetR11_2: R11.2 VT4.1
NetR12_1: R12.1 U4.2
NetR14_1: R14.1 U5.3
NetR14_2: R14.2 VT5.1
NetR15_1: R15.1 U5.2
NetR17_1: R17.1 U6.3
NetR17_2: R17.2 VT6.1
NetR18_1: R18.1 U6.2
NetR20_1: R20.1 U7.3
NetR20_2: R20.2 VT7.1
NetR21_1: R21.1 U7.2
NetR23_1: R23.1 U8.3
NetR23_2: R23.2 VT8.1
NetR24_1: R24.1 U8.2
NetR26_1: R26.1 U9.3
NetR26_2: R26.2 VT9.1
NetR27_1: R27.1 U9.2
NetR29_1: R29.1 U10.3
NetR29_2: R29.2 VT10.1
NetR30_1: R30.1 U10.2
NetR32_1: R32.1 U11.3
NetR32_2: R32.2 VT11.1
NetR33_1: R33.1 U11.2
NetR35_1: R35.1 U12.3
NetR35_2: R35.2 VT12.1
NetR36_1: R36.1 U12.2
NetR38_1: R38.1 U13.3
NetR38_2: R38.2 VT13.1
NetR39_1: R39.1 U13.2
NetR41_1: R41.1 U14.3
NetR41_2: R41.2 VT14.1
NetR42_1: R42.1 U14.2
NetR44_1: R44.1 U15.3
NetR44_2: R44.2 VT15.1
NetR45_1: R45.1 U15.2
NetR47_1: R47.1 U16.3
NetR47_2: R47.2 VT16.1
NetR48_1: R48.1 U16.2
NetR50_1: R50.1 U18.3
NetR50_2: R50.2 VT17.1
NetR51_1: R51.1 U18.2
NetR53_1: R53.1 U19.3
NetR53_2: R53.2 VT18.1
NetR54_1: R54.1 U19.2
NetR56_1: R56.1 U20.3
NetR56_2: R56.2 VT19.1
NetR57_1: R57.1 U20.2
NetR59_1: R59.1 U21.3
NetR59_2: R59.2 VT20.1
NetR60_1: R60.1 U21.2
NetR62_1: R62.1 U22.3
NetR62_2: R62.2 VT21.1
NetR63_1: R63.1 U22.2
NetR65_1: R65.1 U23.3
NetR65_2: R65.2 VT22.1
NetR66_1: R66.1 U23.2
NetR68_1: R68.1 U24.3
NetR68_2: R68.2 VT23.1
NetR69_1: R69.1 U24.2
NetR71_1: R71.1 U25.3
NetR71_2: R71.2 VT24.1
NetR72_1: R72.1 U25.2
NetR145_2: R145.2 U35.12(STCP) ; port SPI1_CS1
NetR146_2: R146.2 U36.12(STCP) ; port SPI1_CS2
NetU34_1: U34.1(COM_I/O) ; port TS_IN_COM
NetU34_10: U34.10(S_0) ; port S_0
NetU34_11: U34.11(S_1) ; port S_1
NetU34_13: U34.13(S_3) ; port S_3
NetU34_14: U34.14(S_2) ; port S_2

Not connected (* = marked no-connect by the designer): K1 3(NC); K2 3(NC); K3 3(NC); K4 3(NC); K5 3(NC); K6 3(NC); K7 3(NC); K8 3(NC); K9 3(NC); K10 3(NC); K11 3(NC); K12 3(NC); K13 3(NC); K14 3(NC); K15 3(NC); K16 3(NC); K17 3(NC); K18 3(NC); K19 3(NC); K20 3(NC); K21 3(NC); K22 3(NC); K23 3(NC); K24 3(NC); U35 9(Q7S); U36 9(Q7S); XP1 10(A10) 19(A19)

### Notes on the sheet
- Labels drawn without touching a wire or pin: GND

### Library data of the parts
C1 C2 = Ceramic_2220: Name: Capacitor; Value: 10uF, 25V, X7R; Help URL: https://ru.mouser.com/ProductDetail/KEMET/C2220C106K3RACTU?qs=AiEy7T%252BpANdh8MDp0HivKw%3D%3D; Mount: 2220
K1-K24 = RM96-3011-35-1012: Relay 12V DC; 8А; 8A/250ВAC;; Manufacturer: Производитель; Datasheet: https://www.tme.eu/Document/00f3bdd8399fa4342821d33e99da3c32/RM96_EN.pdf; HelpURL: https://www.tme.eu/ru/details/rm96-3011-35-1012/rele-elektromagn-miniatiurnye/relpol/; Product Category: Relays
R1-R72 = Resistor_0402: Tolerance: ±5%; Product Category: Resistors; Package/Case: 0402; Temperature: -55...+125°C
R145-R148 = Resistor_0603: Value: 10K; Help URL: https://www.chipdip.by/product0/9000079736; Mount: 0603; Name: Resistor
U1-U16 U18-U25 = LTV-357T: Transistor Output Optocouplers Optocoupler Phototrans; Manufacturer: Lite-On; Datasheet: https://eu.mouser.com/datasheet/2/239/LTV-357T_series_RevP-1543500.pdf; HelpURL: https://eu.mouser.com/ProductDetail/Lite-On/LTV-357T?qs=IhlP1sn3qi5zhJzi4zUCwQ%3D%3D; Package/Case: SMD-4; Product Category: Optocouplers
U17 = AM1D-1212SH: Linear Voltage Regulator IC 1 Output 800mA SOT-223; Value: AM1D-1212SH30Z; Help URL: https://www.digikey.com/en/products/detail/aimtec/AM1D-1212SH30Z/12439892; Mount: 7-SIP; Name: Regulator
U34 = CD74HC4067M96: 1 MHz, Low-Power Op Amp; Manufacturer: Texas Instruments; Datasheet: https://www.ti.com/general/docs/suppproductinfo.tsp?distId=26&gotoUrl=https://www.ti.com/lit/gpn/cd74hct4067; HelpURL: https://eu.mouser.com/ProductDetail/Texas-Instruments/CD74HC4067M96?qs=xFfolx0DHx0XT7d9xTTZBA%3D%3D; Package/Case: SOIC-24; Product Category: Multiplexers
U35 U36 = 74HC595: Name: Shift register; Value: 74HC595D; Help URL: https://www.chipdip.by/product/74hc595d; Mount: SOIC-16
VD1-VD24 = 1N4148W-7-F: Diodes - General Purpose, Power, Switching SURFACE MOUNT FAST SWITCHING DIODE; Manufacturer: Diodes Incorporated; Datasheet: https://www.diodes.com/assets/Datasheets/BAV16W_1N4148W.pdf; HelpURL: https://eu.mouser.com/ProductDetail/Diodes-Incorporated/1N4148W-7-F?qs=LHX0FizJzg7Ae9ZM8LTAWw%3D%3D; Package/Case: SOD-123; Product Category: Diodes
VT1-VT24 = 2N7002: MOSFET N-CHANNEL 60V 115mA; Manufacturer: Fairchild; Datasheet: https://eu.mouser.com/datasheet/2/308/NDS7002A_D-1522662.pdf; HelpURL: https://eu.mouser.com/ProductDetail/onsemi-Fairchild/2N7002?qs=0dwsXDNhqlz66WJJhrTFjQ%3D%3D; Package/Case: SOT-23; Product Category: MOSFET; Analogue: NX7002AK
XP1 = DRB-37FA(DS1037-37F): Сonnector; Manufacturer: Connfly; Analogue: HARTING 09221326951(https://eu.mouser.com/ProductDetail/HARTING/09221326951?qs=Afqhj6cPmO9f0oVZo6yWiA%3D%3D); Datasheet: http://en.connfly.group/static/upload/file/pdf/DS1118.pdf; HelpURL: https://www.chipdip.by/product/din41612r-ds1118-32m-r23; Product Category: Connectors

## Nets that join several sheets
+12V: TU_PWR (XP3.15 XP3.16 XP3.17 XP3.18), TU_ADV_SCH (74 pins)
GND: TU_PWR (19 pins), TU_MCU (6 pins), TU_ADV_SCH (15 pins)
GND_12V: TU_PWR (XP3.13 XP3.14 XP3.19 XP3.20), TU_ADV_SCH (24 pins)
VCC_3.3V_CLEAR: TU_PWR (15 pins), TU_MCU (7 pins), TU_ADV_SCH (5 pins)
NetR145_2: TU_MCU (U38.19), TU_ADV_SCH (R145.2 U35.12)
NetR146_2: TU_MCU (U38.20), TU_ADV_SCH (R146.2 U36.12)
NetU34_1: TU_MCU (U38.26), TU_ADV_SCH (U34.1)
NetU34_10: TU_MCU (U38.27), TU_ADV_SCH (U34.10)
NetU34_11: TU_MCU (U38.29), TU_ADV_SCH (U34.11)
NetU34_13: TU_MCU (U38.24), TU_ADV_SCH (U34.13)
NetU34_14: TU_MCU (U38.25), TU_ADV_SCH (U34.14)
SPI1_MOSI: TU_MCU (U38.23), TU_ADV_SCH (R148.2 U35.14 U36.14)
SPI1_SCK: TU_MCU (U38.21), TU_ADV_SCH (R147.2 U35.11 U36.11)
SPI2_MISO: TU_PWR (XP3.3 XP3.30), TU_MCU (U38.35)
SPI2_MOSI: TU_PWR (XP3.2 XP3.31), TU_MCU (U38.36)
SPI2_NSS: TU_PWR (XP3.1 XP3.32), TU_MCU (U38.33)
SPI2_SCK: TU_PWR (XP3.4 XP3.29), TU_MCU (U38.34)